# Altium schematic sheet rsx_low_power_board In Going Connectors.SchDoc
size A4
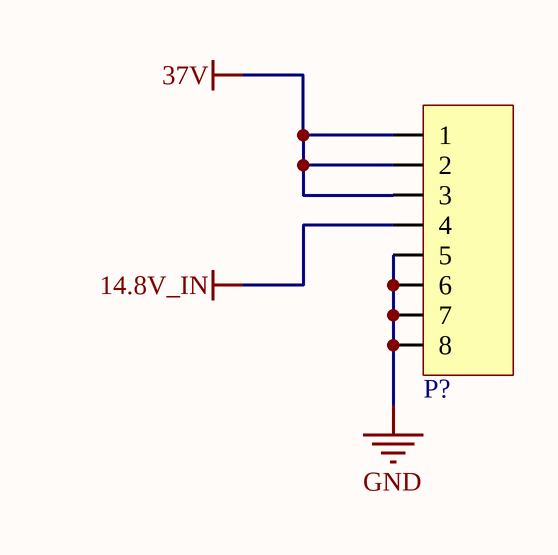
[diagram p0: rsx_low_power_board In Going Connectors.SchDoc]

## Parts
P?  Mini-Fit Jr 8 Pos  [Molex Mini-Fit Jr 0039281083]  (value not drawn)

## Nets
14.8V_IN: P?.4
37V: P?.1 P?.2 P?.3
GND: P?.5 P?.6 P?.7 P?.8

## Library data of the parts
P? = Molex Mini-Fit Jr 8pos Vert